# Altium schematic sheet SH5 - MICROCONTROLLER.SchDoc: Microcontroller
size B; CheckedBy: Lance Bantoto; Engineer: Aidan Gratton; Organization: UW Robotics; Address1: 200 University Avenue; Address2: Waterloo; Address3: Ontario; Address4: Canada N2L 3G6; Revision: 2; SheetNumber: 5; SheetTotal: 6
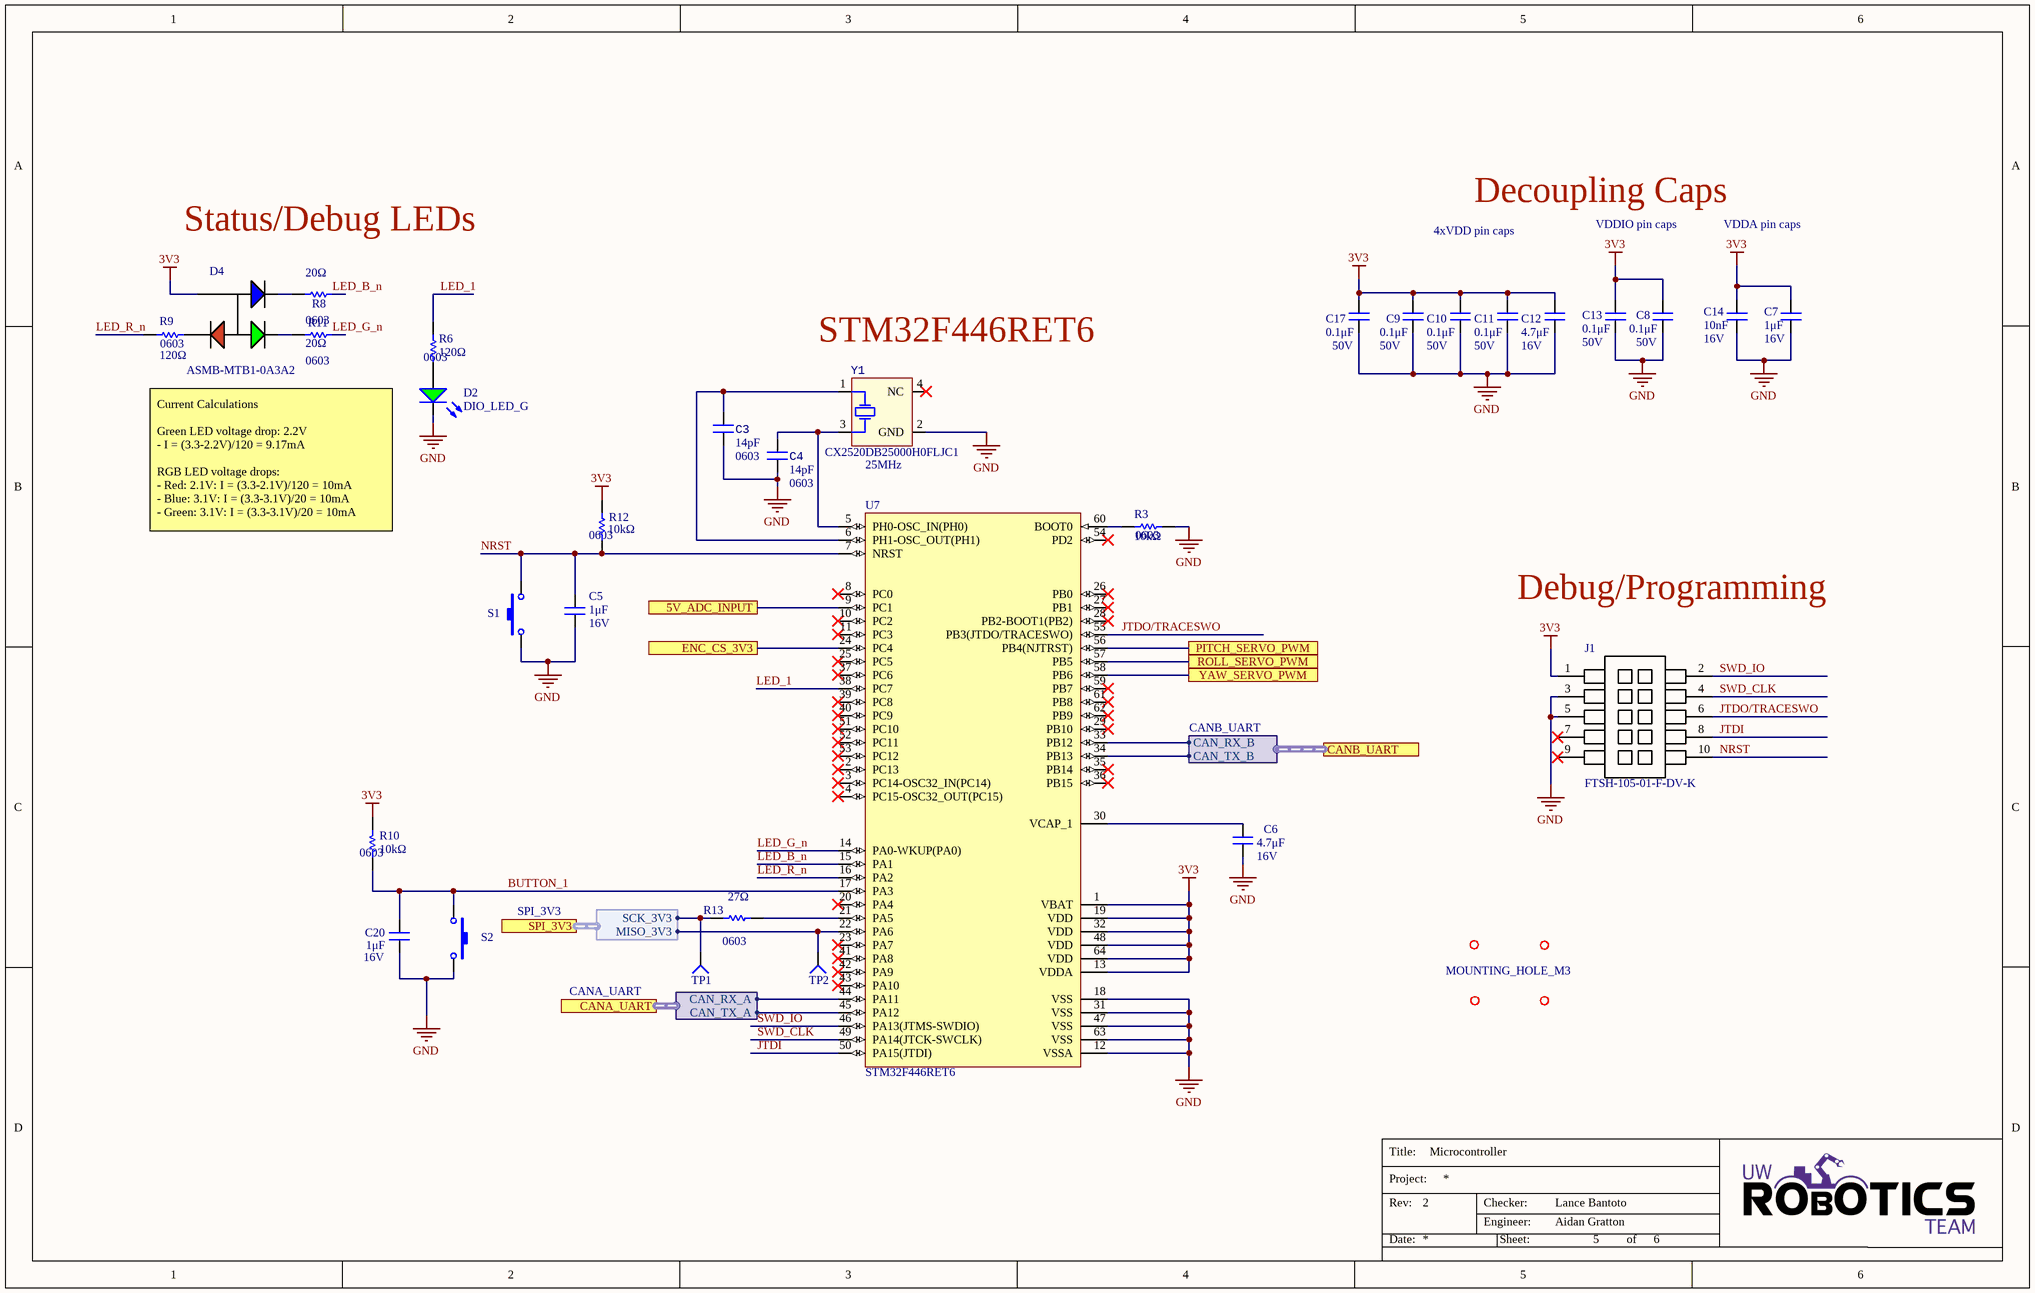
[diagram p0: SH5 - MICROCONTROLLER.SchDoc]

## Parts
C3  value 14pF  Package/Footprint: 0603  [CAP0603]  (hidden comment: CAP_14pF_50V_0603)
C4  value 14pF  Package/Footprint: 0603  [CAP0603]  (hidden comment: CAP_14pF_50V_0603)
C5  value 1μF  Voltage Rating: 16V  [CAP2012]  (hidden comment: CAP_1uF_16V_0805)
C6  value 4.7μF  Voltage Rating: 16V  [CAP2012]  (hidden comment: CAP_4.7uF_16V_0805)
C7  value 1μF  Voltage Rating: 16V  [CAP0603]  (hidden comment: CAP_1uF_16V_0603)
C8  value 0.1μF  Voltage Rating: 50V  [CAP0603]  (hidden comment: CAP_0.1uF_50V_0603)
C9  value 0.1μF  Voltage Rating: 50V  [CAP0603]  (hidden comment: CAP_0.1uF_50V_0603)
C10  value 0.1μF  Voltage Rating: 50V  [CAP0603]  (hidden comment: CAP_0.1uF_50V_0603)
C11  value 0.1μF  Voltage Rating: 50V  [CAP0603]  (hidden comment: CAP_0.1uF_50V_0603)
C12  value 4.7μF  Voltage Rating: 16V  [CAP2012]  (hidden comment: CAP_4.7uF_16V_0805)
C13  value 0.1μF  Voltage Rating: 50V  [CAP0603]  (hidden comment: CAP_0.1uF_50V_0603)
C14  value 10nF  Voltage Rating: 16V  [CAP0603]  (hidden comment: CAP_10nF_0603)
C17  value 0.1μF  Voltage Rating: 50V  [CAP0603]  (hidden comment: CAP_0.1uF_50V_0603)
C20  value 1μF  Voltage Rating: 16V  [CAP2012]  (hidden comment: CAP_1uF_16V_0805)
D2  DIO_LED_G  [LED_0805_GREEN]
D4  Manufacturer Part Number 1: ASMB-MTB1-0A3A2  [LED_RGB]  (hidden comment: LED_RGB)
J1  Manufacturer Part Number 1: FTSH-105-01-F-DV-K  [FTSH-105-01-F-DV-K-P-TR]  (hidden comment: CON_PROGRAMMING)
MH1  MOUNTING_HOLE_M3  [MOUNTING_HOLE_3mm_GIMBAL_REV2]  (value not drawn)  (no BOM)
MH2  MOUNTING_HOLE_M3  [MOUNTING_HOLE_3mm_GIMBAL_REV2]  (value not drawn)  (no BOM)
MH3  MOUNTING_HOLE_M3  [MOUNTING_HOLE_3mm_GIMBAL_REV2]  (value not drawn)  (no BOM)
MH4  MOUNTING_HOLE_M3  [MOUNTING_HOLE_3mm_GIMBAL_REV2]  (no BOM)
R3  value 10kΩ  Package/Footprint: 0603  [RESC0603]  (hidden comment: RES_10kΩ_0603_5%)
R6  value 120Ω  Package/Footprint: 0603  [RESC0603]  (hidden comment: RES_120Ω_0603)
R8  value 20Ω  Package/Footprint: 0603  [RESC0603]  (hidden comment: RES_20Ω_0603_5%)
R9  value 120Ω  Package/Footprint: 0603  [RESC0603]  (hidden comment: RES_120Ω_0603)
R10  value 10kΩ  Package/Footprint: 0603  [RESC0603]  (hidden comment: RES_10kΩ_0603_5%)
R11  value 20Ω  Package/Footprint: 0603  [RESC0603]  (hidden comment: RES_20Ω_0603_5%)
R12  value 10kΩ  Package/Footprint: 0603  [RESC0603]  (hidden comment: RES_10kΩ_0603_5%)
R13  Resistance: 27Ω  Package/Footprint: 0603  [RESC0603]  (hidden comment: RES_27Ω_0603_5%)
S1  SW_TACTILE  [B3U-1000P]  (value not drawn)
S2  SW_TACTILE  [B3U-1000P]  (value not drawn)
TP1  TESTPOINT_1MM_CIRCLE  [TESTPOINT_CIRCLE_1MM]  (value not drawn)  (no BOM)
TP2  TESTPOINT_1MM_CIRCLE  [TESTPOINT_CIRCLE_1MM]  (value not drawn)  (no BOM)
U7  STM32F446RET6  [STM-LQFP64_L]
Y1  Manufacturer Part Number 1: CX2520DB25000H0FLJC1  Frequency: 25MHz  [SOIC254P1016X440-4N]  (hidden comment: CRYSTAL_25MHZ)

## Ports
5V_ADC_INPUT, CANA_UART (harness CANA_UART), CANB_UART (harness CANB_UART), ENC_CS_3V3, PITCH_SERVO_PWM, ROLL_SERVO_PWM, SPI_3V3 (harness SPI_3V3), YAW_SERVO_PWM

## Harnesses
CANA_UART: CAN_RX_A, CAN_TX_A
CANB_UART: CAN_RX_B, CAN_TX_B
SPI_3V3: SCK_3V3, MISO_3V3

## Nets
3V3: C7.2 C8.2 C9.2 C10.2 C11.2 C12.2 C13.2 C14.2 C17.2 D4.4(COMMON_ANODE) J1.1 R10.1 R12.2 U7.1(VBAT) U7.13(VDDA) U7.19(VDD) U7.32(VDD) U7.48(VDD) U7.64(VDD)
GND: C3.1 C4.1 C5.1 C6.1 C7.1 C8.1 C9.1 C10.1 C11.1 C12.1 C13.1 C14.1 C17.1 C20.1 D2.2(K) J1.3 J1.5 R3.2 S1.1 S2.1 U7.12(VSSA) U7.18(VSS) U7.31(VSS) U7.47(VSS) U7.63(VSS) Y1.2(GND)
5V_ADC_INPUT: U7.9(PC1) ; port 5V_ADC_INPUT
BUTTON_1: C20.2 R10.2 S2.2 U7.17(PA3)
ENC_CS_3V3: U7.24(PC4) ; port ENC_CS_3V3
JTDI: J1.8 U7.50(PA15(JTDI))
JTDO/TRACESWO: J1.6 U7.55(PB3(JTDO/TRACESWO))
LED_1: R6.1 U7.38(PC7)
LED_B_n: R8.2 U7.15(PA1)
LED_G_n: R11.2 U7.14(PA0-WKUP(PA0))
LED_R_n: R9.1 U7.16(PA2)
NRST: C5.2 J1.10 R12.1 S1.2 U7.7(NRST)
PITCH_SERVO_PWM: U7.56(PB4(NJTRST)) ; port PITCH_SERVO_PWM
ROLL_SERVO_PWM: U7.57(PB5) ; port ROLL_SERVO_PWM
SWD_CLK: J1.4 U7.49(PA14(JTCK-SWCLK))
SWD_IO: J1.2 U7.46(PA13(JTMS-SWDIO))
YAW_SERVO_PWM: U7.58(PB6) ; port YAW_SERVO_PWM
NetC3_2: C3.2 U7.6(PH1-OSC_OUT(PH1)) Y1.1(HOT)
NetC4_2: C4.2 U7.5(PH0-OSC_IN(PH0)) Y1.3(HOT)
NetC6_2: C6.2 U7.30(VCAP_1)
NetD2_1: D2.1(A) R6.2
NetD4_1: D4.1(CATHODE_(RED)) R9.2
NetD4_2: D4.2(CATHODE_(GREEN)) R11.1
NetD4_3: D4.3(CATHODE_(BLUE)) R8.1
NetR3_1: R3.1 U7.60(BOOT0)
NetR13_1: R13.1 TP1.1(=value) ; port SPI_3V3.SCK_3V3
NetR13_2: R13.2 U7.21(PA5)
NetTP2_1: TP2.1(=value) U7.22(PA6) ; port SPI_3V3.MISO_3V3
NetU7_33: U7.33(PB12) ; port CANB_UART.CAN_RX_B
NetU7_34: U7.34(PB13) ; port CANB_UART.CAN_TX_B
NetU7_44: U7.44(PA11) ; port CANA_UART.CAN_RX_A
NetU7_45: U7.45(PA12) ; port CANA_UART.CAN_TX_A

Not connected (* = marked no-connect by the designer): J1 7* 9*; U7 2(PC13)* 3(PC14-OSC32_IN(PC14))* 4(PC15-OSC32_OUT(PC15))* 8(PC0)* 10(PC2)* 11(PC3)* 20(PA4)* 23(PA7)* 25(PC5)* 26(PB0)* 27(PB1)* 28(PB2-BOOT1(PB2))* 29(PB10)* 35(PB14)* 36(PB15)* 37(PC6)* 39(PC8)* 40(PC9)* 41(PA8)* 42(PA9)* 43(PA10)* 51(PC10)* 52(PC11)* 53(PC12)* 54(PD2)* 59(PB7)* 61(PB8)* 62(PB9)*; Y1 4(NC)*

## Notes on the sheet
- Status/Debug LEDs
- 4xVDD pin caps
- Decoupling Caps
- VDDIO pin caps
- VDDA pin caps
- (near Y1) STM32F446RET6
- Current Calculations
  Green LED voltage drop: 2.2V
  - I = (3.3-2.2V)/120 = 9.17mA
  RGB LED voltage drops:
  - Red: 2.1V: I = (3.3-2.1V)/120 = 10mA
  - Blue: 3.1V: I = (3.3-3.1V)/20 = 10mA
  - Green: 3.1V: I = (3.3-3.1V)/20 = 10mA
- Debug/Programming
- Title:
- Project:
- Date:
- Rev:
- Checker:
- Engineer:
- Sheet:
- of

## Library data of the parts
C3 C4 = CAP_14pF_50V_0603: CAP CER 14PF 50V C0G/NP0 0603; Manufacturer 1: Samsung; Manufacturer Part Number 1: CL10C140JB8NNNC; Dielectric: C0G; Voltage Rating: 50V; Supplier Part Number 1: 1276-2187-1-ND; Supplier 1: Digi-Key; Mounting Type: SMD
C5 C20 = CAP_1uF_16V_0805: CAP CER 1UF 16V X7R 0805; Manufacturer 1: Yageo; Manufacturer Part Number 1: CC0805KKX7R7BB105; Tolerance: 10%; Package/Footprint: 0805; Mount: Surface Mount; Case Code (Metric): 2012; Case Code (Imperial): 0805; Min Operating Temperature: -55°C; Max Operating Temperature: 125°C; Dielectric: X7R; Supplier 1: Digi-Key; Supplier Part Number 1: 311-1365-1-ND; Mounting Type: SMD
C6 C12 = CAP_4.7uF_16V_0805: CAP CER 4.7UF 16V X5R 0805; Manufacturer Part Number 1: CL21A475KOFNNNE; Manufacturer 1: Samsung Electro-Mechanics; Package/Footprint: 0805; Supplier Part Number 1: 1276-1065-1-ND; Supplier 1: Digi-Key; Dielectric: X5R; Mounting Type: SMD; LCSC Part #: C1779
C7 = CAP_1uF_16V_0603: CAP CER 1UF 16V Y5V 0603; Manufacturer Part Number: CC0603ZRY5V7BB105; Manufacturer 1: Yageo; Package/Footprint: 0603; Dimensions: 0.063" L x 0.031" W (1.60mm x 0.80mm); Package: 0603 (1608 Metric); Temperature Coefficient: Y5V; Supplier Part Number 1: 311-1372-1-ND; Supplier 1: Digi-Key; Manufacturer Part Number 1: CC0603ZRY5V7BB105; Dielectric: Y5V; Mounting Type: SMD
C8-C11 C13 C17 = CAP_0.1uF_50V_0603: CAP CER 0.1UF 50V X7R 0603; Manufacturer Part Number 1: CC0603KRX7R9BB104; Manufacturer 1: Yageo; Package/Footprint: 0603; Temperature Coefficient: X7R; Supplier Part Number 1: 311-1344-1-ND; Supplier 1: Digi-Key; Dielectric: X7R; Mounting Type: SMD
C14 = CAP_10nF_0603: CAP CER 10000PF 16V X7R 0603; Manufacturer Part Number 1: CC0603KRX7R7BB103; Manufacturer 1: Yageo; Package/Footprint: 0603; Supplier Part Number 1: 311-3369-1-ND; Supplier 1: Digi-Key; Dielectric: X7R; Mounting Type: SMD
D2 = DIO_LED_G: LED GREEN DIFFUSED 0805 SMD; Manufacturer Part Number 1: LG R971-KN-1; Manufacturer 1: OSRAM; Forward Voltage Drop: 2.2V; Package/Footprint: 0805; Supplier Part Number 1: 475-1410-1-ND; Supplier 1: Digi-Key; Mounting Type: SMD
D4 = LED_RGB: LED RGB DIFFUSED 4PLCC SMD; Manufacturer 1: Broadcom; Color: Blue,Green,Red; Lens Color: White; Viewing Angle: 115°; Lens Style: Round; Luminous Intensity: 350mcd; Dominant Wavelength: 470nm; Forward Voltage: 3.1V; Test Current: 20mA; Package/Footprint: 4-PLCC; Supplier 1: Digi-Key; Case/Package: PLCC; Number of Pins: 4; Lens Transparency: Diffused; Length: 3.2mm; Height: 1.9mm; Width: 2.8mm; Supplier Part Number 1: 516-3280-1-ND; Mounting Type: SMD
J1 = CON_PROGRAMMING: CONN HEADER SMD 10POS 1.27MM; Manufacturer 1: Samtec; Max Current Rating: 1.75A; Supplier 1: Digi-Key; Pitch: 1.27mm; Supplier Part Number 1: SAM8796-ND; Mounting Type: SMD; Package/Footprint: SMD
MH1-MH4 = MOUNTING_HOLE_M3_GIMBAL_REV2: MOUNTING_HOLE_M3 Gimbal Rev2
R3 R10 R12 = RES_10kΩ_0603_5%: RES 10K OHM 5% 1/10W 0603; Manufacturer 1: Yageo; Manufacturer Part Number 1: RC0603JR-0710KL; Package: 0603 (1608 Metric); Tolerance: 5%; Supplier Part Number 1: 311-10KGRCT-ND; Supplier 1: Digi-Key; Case Code (Metric): 1608; Mounting Type: SMD
R6 R9 = RES_120Ω_0603_5%: RES 120 OHM 5% 1/10W 0603; Manufacturer 1: Yageo; Manufacturer Part Number 1: RC0603JR-07120RL; Package: 0603 (1608 Metric); Supplier Part Number 1: 311-120GRCT-ND; Supplier 1: Digi-Key; Mounting Type: SMD
R8 R11 = RES_20Ω_0603_5%: RES 20 OHM 5% 1/10W 0603; Manufacturer 1: Yageo; Manufacturer Part Number 1: RC0603JR-0720RL; Package: 0603 (1608 Metric); Dimensions: 0.063" L x 0.031" W (1.60mm x 0.80mm); Tolerance: 5%; Supplier Part Number 1: 311-20GRCT-ND; Supplier 1: Digi-Key; Mounting Type: SMD
R13 = RES_27Ω_0603_5%: RES 27 OHM 5% 1/10W 0603; Manufacturer Part Number 1: RC0603JR-0727RL; Manufacturer 1: Yageo; Supplier 1: Digi-Key; Supplier Part Number 1: 311-27GRCT-ND; Tolerance: 5%; Mounting Type: SMD
S1 S2 = SW_TACTILE: SWITCH TACTILE SPST-NO 0.05A 12V; Manufacturer 1: Omron Electronics Inc-EMC Div; Package/Footprint: SMD; Manufacturer Part Number 1: B3U-1000P; Supplier 1: Digi-Key; Supplier Part Number 1: SW1020CT-ND; Mounting Type: SMD
TP1 TP2 = TESTPOINT_1MM_CIRCLE: TESTPOINT 1MM CIRCLE; Part Number (MPN): *
U7 = MCU_STM32F446RET6: ARM Cortex-M4 32-bit MCU+FPU, 512 KB Flash, 128 KB Internal RAM, 50 I/Os, 64-Pin LQFP, -40 to 85 degC, Tray; I/Os (High Current): 50; Supply Voltage(Vcc) min (V): 1.7; Operating Frequency(F) (Processor speed) (MHz): 180; D/A Converter: 2; Internal RAM Size (kB): 128; FLASH Size (Prog) (kB): 512; Core: ARM Cortex-M4; ComponentLink1Description: Manufacturer URL; Package Reference: 64-Pin Low-profile Quad Flat Package, Body 10 x 10 mm, Pitch 0.5 mm; ComponentLink2URL: http://www.st.com/st-web-ui/static/active/en/resource/technical/document/datasheet/DM00141306.pdf; Packing: Tray; DatasheetVersion: Rev. 6; ComponentLink1URL: http://www.st.com/; ComponentLink2Description: Datasheet; Package Description: LQFP64; Mounting Technology: Surface Mount; Supplier Part Number 1: 497-15376-ND; Supplier 1: Digi-Key
Y1 = CRYSTAL_25MHZ: CRYSTAL 25.0000MHZ 12PF SMD; Manufacturer 1: Kyocera AVX; Supplier 1: Digi-Key; Supplier Part Number 1: 1253-1724-1-ND; Load Capacitance: 12pF; Mounting Type: SMD; Package/Footprint: SMD